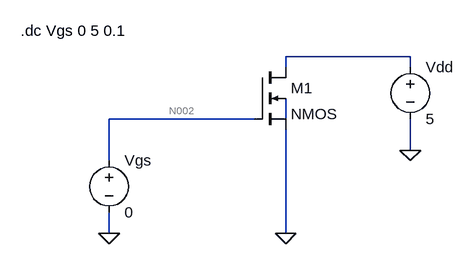
[diagram p0: schematic LAB1_NMOS.asc]
LAB1_NMOS.asc, the LTspice schematic file:
Version 4
SHEET 1 936 680
WIRE 368 240 176 240
WIRE 176 256 176 240
WIRE 368 256 368 240
WIRE 128 336 -96 336
WIRE 176 336 176 304
WIRE 368 384 368 336
WIRE -96 400 -96 336
WIRE -96 512 -96 480
WIRE 176 512 176 352
FLAG 368 384 0
FLAG -96 512 0
FLAG 176 512 0
SYMBOL nmos4 128 256 R0
SYMATTR InstName M1
SYMATTR Value2 l=20u w=100u
SYMBOL voltage -96 384 R0
WINDOW 123 0 0 Left 0
WINDOW 39 0 0 Left 0
SYMATTR InstName Vgs
SYMATTR Value 0
SYMBOL voltage 368 240 R0
WINDOW 123 0 0 Left 0
WINDOW 39 0 0 Left 0
SYMATTR InstName Vdd
SYMATTR Value 5
TEXT -232 200 Left 2 !.dc Vgs 0 5 0.1

The netlist it stands for:
* LAB1_NMOS.asc
M1 N001 N002 0 N003 NMOS l=20u w=100u
Vgs N002 0 0
Vdd N001 0 5
.model NMOS NMOS
.model PMOS PMOS
.lib standard.mos
.dc Vgs 0 5 0.1
.backanno
.end

* Results of the author's LTspice run, read from the files saved beside the schematic
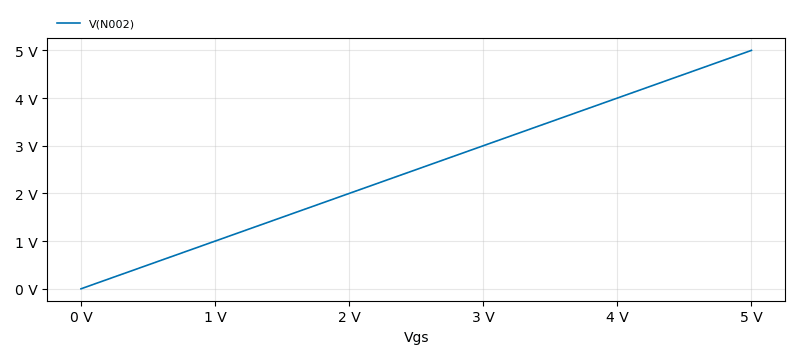
[diagram p1: DC transfer characteristic of LAB1_NMOS.asc, plotted from the saved traces]
* DC transfer characteristic, 1 run:
*   V(N002): 0 V at Vgs=0 V, 5 V at Vgs=5 V, min 0 V, max 5 V